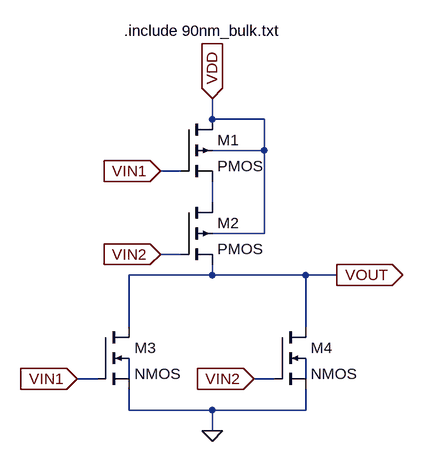
[diagram p0: schematic NOR.asc]
NOR.asc, the LTspice schematic file:
Version 4
SHEET 1 880 680
WIRE 208 96 208 64
WIRE 288 96 208 96
WIRE 288 144 288 96
WIRE 288 144 208 144
WIRE 160 176 128 176
WIRE 208 224 208 192
WIRE 288 272 288 144
WIRE 288 272 208 272
WIRE 160 304 128 304
WIRE 208 336 208 320
WIRE 208 336 80 336
WIRE 352 336 208 336
WIRE 400 336 352 336
WIRE 80 416 80 336
WIRE 352 416 352 336
WIRE 32 496 0 496
WIRE 80 496 80 464
WIRE 304 496 272 496
WIRE 352 496 352 464
WIRE 80 544 80 512
WIRE 208 544 80 544
WIRE 352 544 352 512
WIRE 352 544 208 544
WIRE 208 576 208 544
FLAG 128 176 VIN1
IOPIN 128 176 In
FLAG 0 496 VIN1
IOPIN 0 496 In
FLAG 128 304 VIN2
IOPIN 128 304 In
FLAG 272 496 VIN2
IOPIN 272 496 In
FLAG 208 64 VDD
IOPIN 208 64 In
FLAG 400 336 VOUT
IOPIN 400 336 Out
FLAG 208 576 0
SYMBOL pmos4 160 96 R0
SYMATTR InstName M1
SYMATTR Value2 l=90n w=400n
SYMBOL pmos4 160 224 R0
SYMATTR InstName M2
SYMATTR Value2 l=90n w=400n
SYMBOL nmos4 32 416 R0
SYMATTR InstName M3
SYMATTR Value2 l=90n w=200n
SYMBOL nmos4 304 416 R0
SYMATTR InstName M4
SYMATTR Value2 l=90n w=200n
TEXT 72 -40 Left 2 !.include 90nm_bulk.txt

The netlist it stands for:
* NOR.asc
M1 VDD VIN1 N001 VDD PMOS l=90n w=400n
M2 N001 VIN2 VOUT VDD PMOS l=90n w=400n
M3 VOUT VIN1 0 N002 NMOS l=90n w=200n
M4 VOUT VIN2 0 N003 NMOS l=90n w=200n
.model NMOS NMOS
.model PMOS PMOS
.lib standard.mos
.include 90nm_bulk.txt
.backanno
.end